# Altium schematic sheet 08 MCU_LINK_DEBUG.SchDoc
size 513 x 386 mm
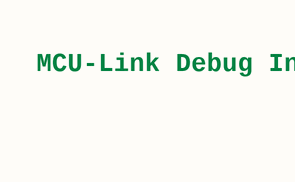
[diagram p0: 08 MCU_LINK_DEBUG.SchDoc, left]
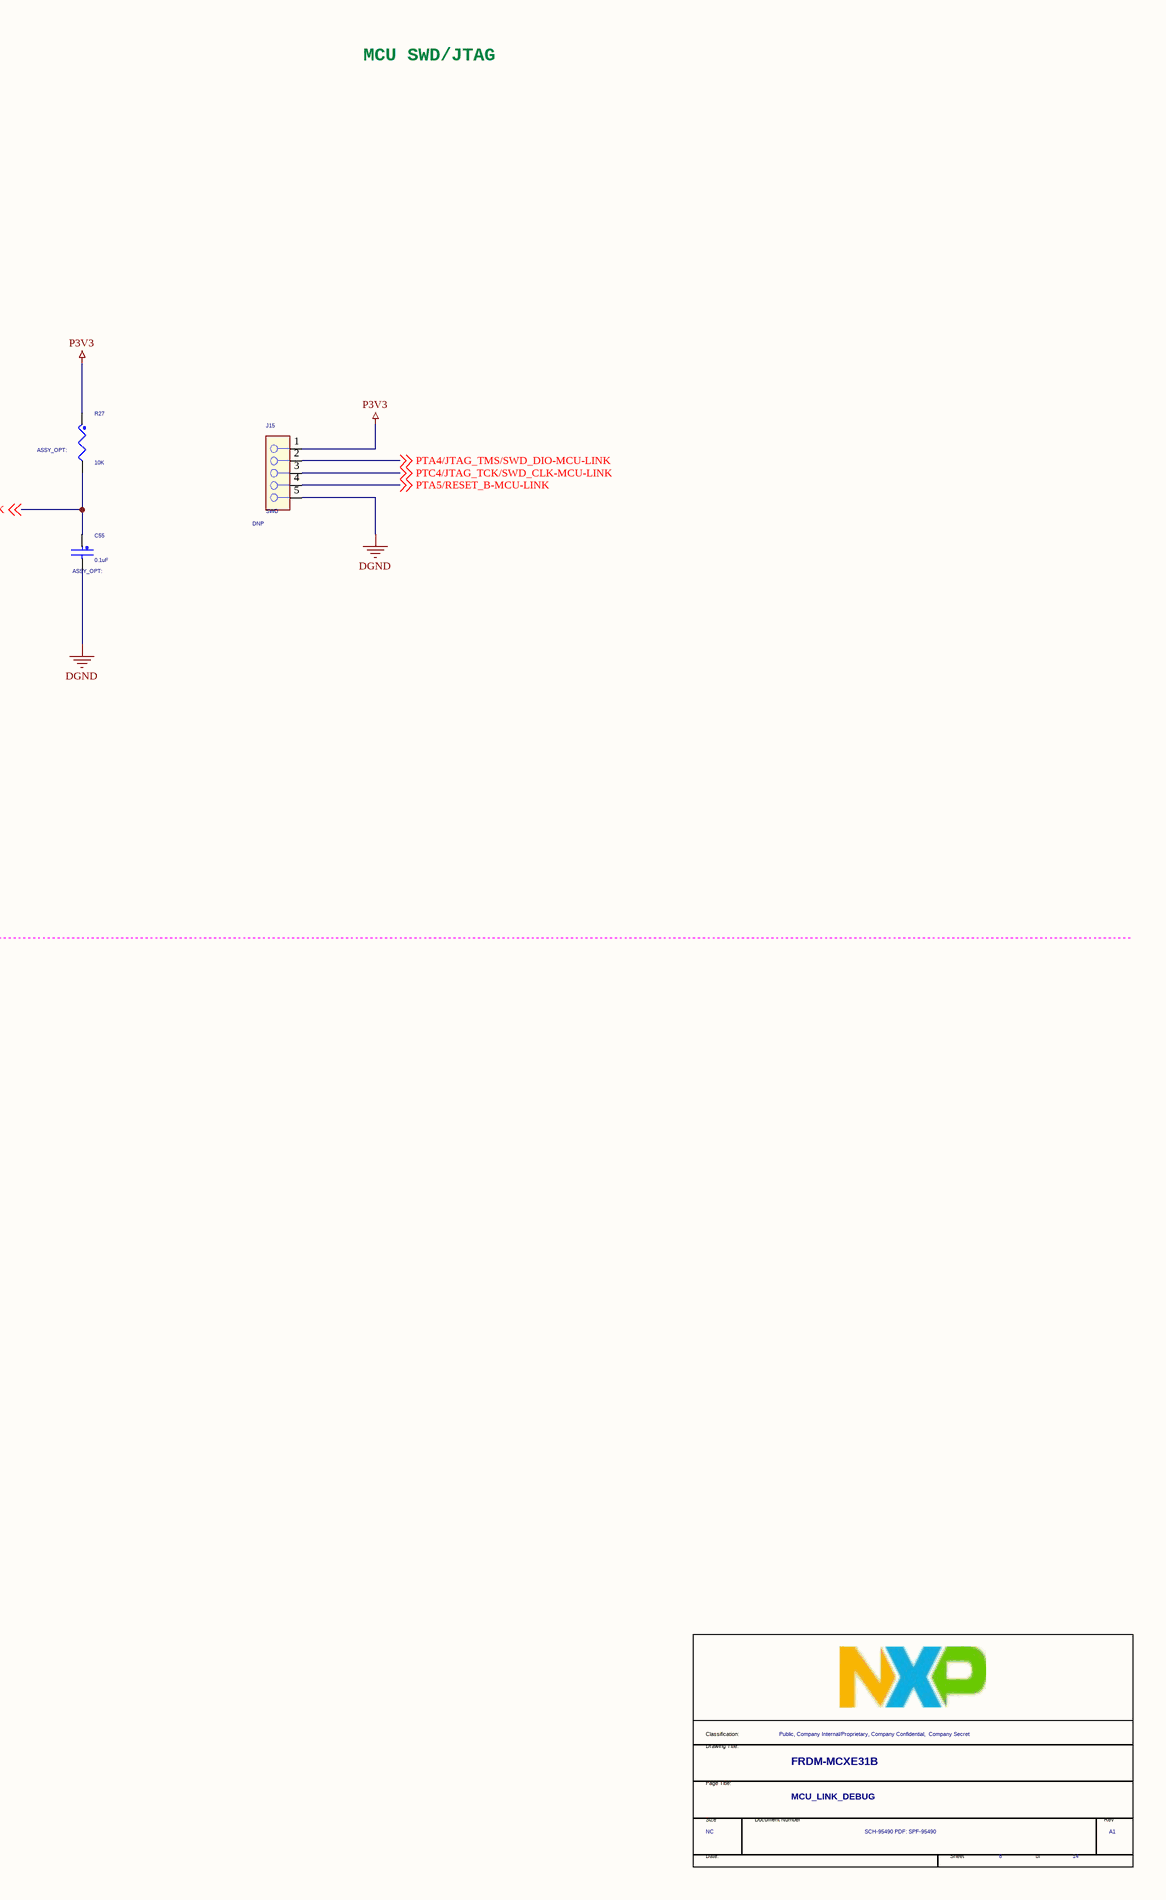
[diagram p1: 08 MCU_LINK_DEBUG.SchDoc, right]

## Parts
*  Title: FRDM-MCXE31B  RevCode: A1  PageTitle: MCU_LINK_DEBUG  Page Size: NC  Page Number: 8  Page Count: 14  Doc: SCH-95490 PDF: SPF-95490  Classification: Public, Company Internal/Proprietary, Company Confidential,  Company Secret  (hidden comment: TitleBlock_FS)  (graphical)
C55  0.1uF  [CC0402_25]
J15  ASSY_OPT: DNP  SILK: SWD  [HDR2.54-Y-LI-5P]  (hidden comment: HDR_1X5)
R27  10K  [RC0402_25]

## Nets
DGND: C55.2 J15.5
P3V3: J15.1 R27.1
PTA4/JTAG_TMS/SWD_DIO-MCU-LINK: J15.2 ; off-sheet PTA4/JTAG_TMS/SWD_DIO-MCU-LINK
PTA5/RESET_B-MCU-LINK: C55.1 J15.4 R27.2 ; off-sheet PTA5/RESET_B-MCU-LINK
PTC4/JTAG_TCK/SWD_CLK-MCU-LINK: J15.3 ; off-sheet PTC4/JTAG_TCK/SWD_CLK-MCU-LINK

## Notes on the sheet
- MCU-Link Debug Interface
- MCU SWD/JTAG
- (in symbol TitleBlock_FS) Classification:; Drawing Title:; Page Title:; Size; Document Number; Rev; Date:; Sheet; of

## Library data of the parts
* = TitleBlock_FS: Classification: Company Internal/Proprietary; OrgName: NXP Semiconductors; OrgAddr1: 6501 William Cannon Drive West; OrgAddr2: Austin, TX 78735-8598; Variant Name: <Core Design>; Page Create Date: March  8, 1995
C55 = CAP_NP: CAP CER 0.1UF 16V 10% X7R 0402; CLASS: DISCRETE; Temp_Range: -55癈 to +85癈; FPLIST: CC0402_25,CC0402_HD,0402_CC,CAPC0402_L,cc0402_lamp3; CAD_APPROVED: Yes; MFG_PN01: CL05B104KO5NNNC; MFG_NAME01: Samsung Electro-Mechanics; AGILE_PN: 150-75182; SIGNAL_MODEL: DEFAULT_CAPACITOR_100000pF_2_1; Temp Range: -55C to +125C; VOLTAGE: 16V; TOL: 10%; HEIGHT: 0.635mm; ROHS: NULL; Tolerance: 10%; Rated Voltage: 16V; 3D_Mechanical_Footprint_File: http://fcl.am.freescale.net/ALLEGRO/step/cc0402_25.STEP
J15 = CONN_HDR_5X1: HDR 1X5 RA TH 100MIL 108H AU 120L; CLASS: IO; MFG_PN01: PRPC005SGAN-M71RC; MFG_NAME01: SULLINS ELECTRONICS CORP; Temp Range: -40° C to + 105° C; CAD_APPROVED: Yes; AGILE_PN: 210-10219; 3D_Mechanical_Footprint_File: http://fcl.am.freescale.net/ALLEGRO/step/con1x5_2p54_th_ra.STEP; ROHS: NULL; Contact Voltage: -; Package Type: Through Hole, Right Angle; HEIGHT: 2.74MM
R27 = RES: RES MF 10K 1/16W 5% 0402; CLASS: DISCRETE; Temp_Range: ?5 癈 to +155 癈; FPLIST: RC0402_25,RC0402_HD,0402_CC; CAD_APPROVED: Yes; MFG_PN01: CR0402-JW-103GLF; MFG_NAME01: BOURNS; AGILE_PN: 470-75557; SIGNAL_MODEL: DEFAULT_RESISTOR_10000OHM_2_1; HEIGHT: 0.4MM; TOL: 5%; ROHS: NULL; Tolerance: 5%